# Altium schematic sheet FrameWork.SchDoc
size A4; SheetNumber: 1; SheetTotal: 2
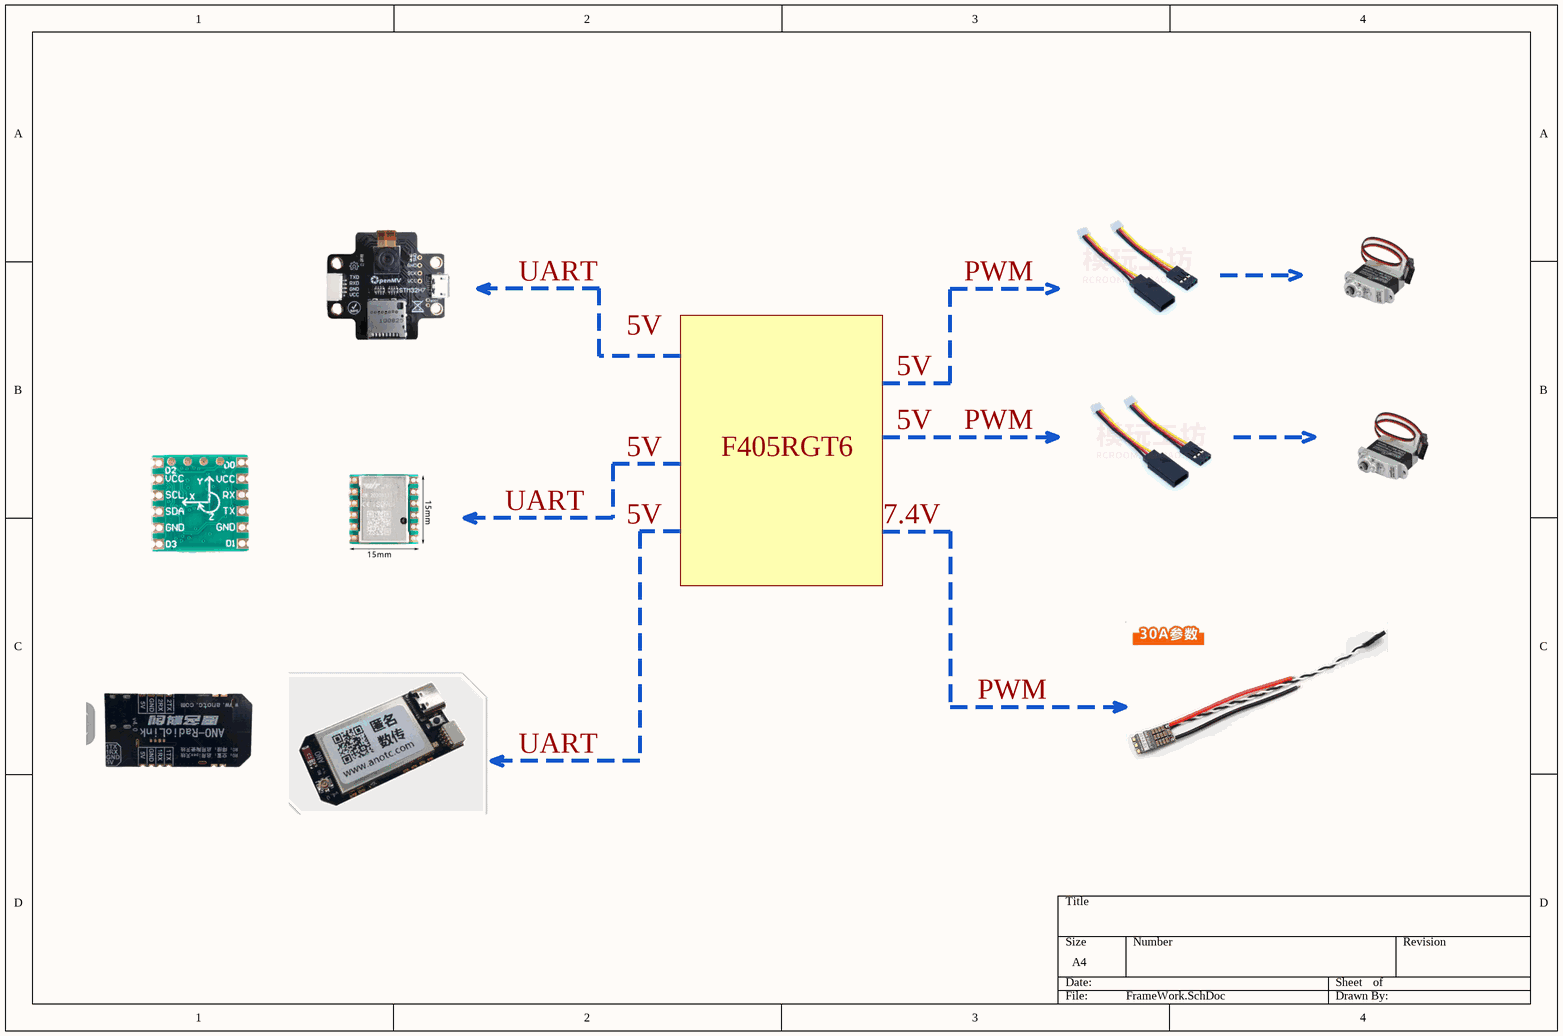
[diagram p0: FrameWork.SchDoc]

## Notes on the sheet
- UART
- PWM
- 5V
- F405RGT6
- 7.4V